# EasyEDA schematic EasyEda_SCH_tally light - main board_2024-01-21.json
TITLE: Main Board; REV: 1.0; Date: 2023-06-19; Sheet: 1/1; Drawn By: michal123456747; Company: Michal Ramus
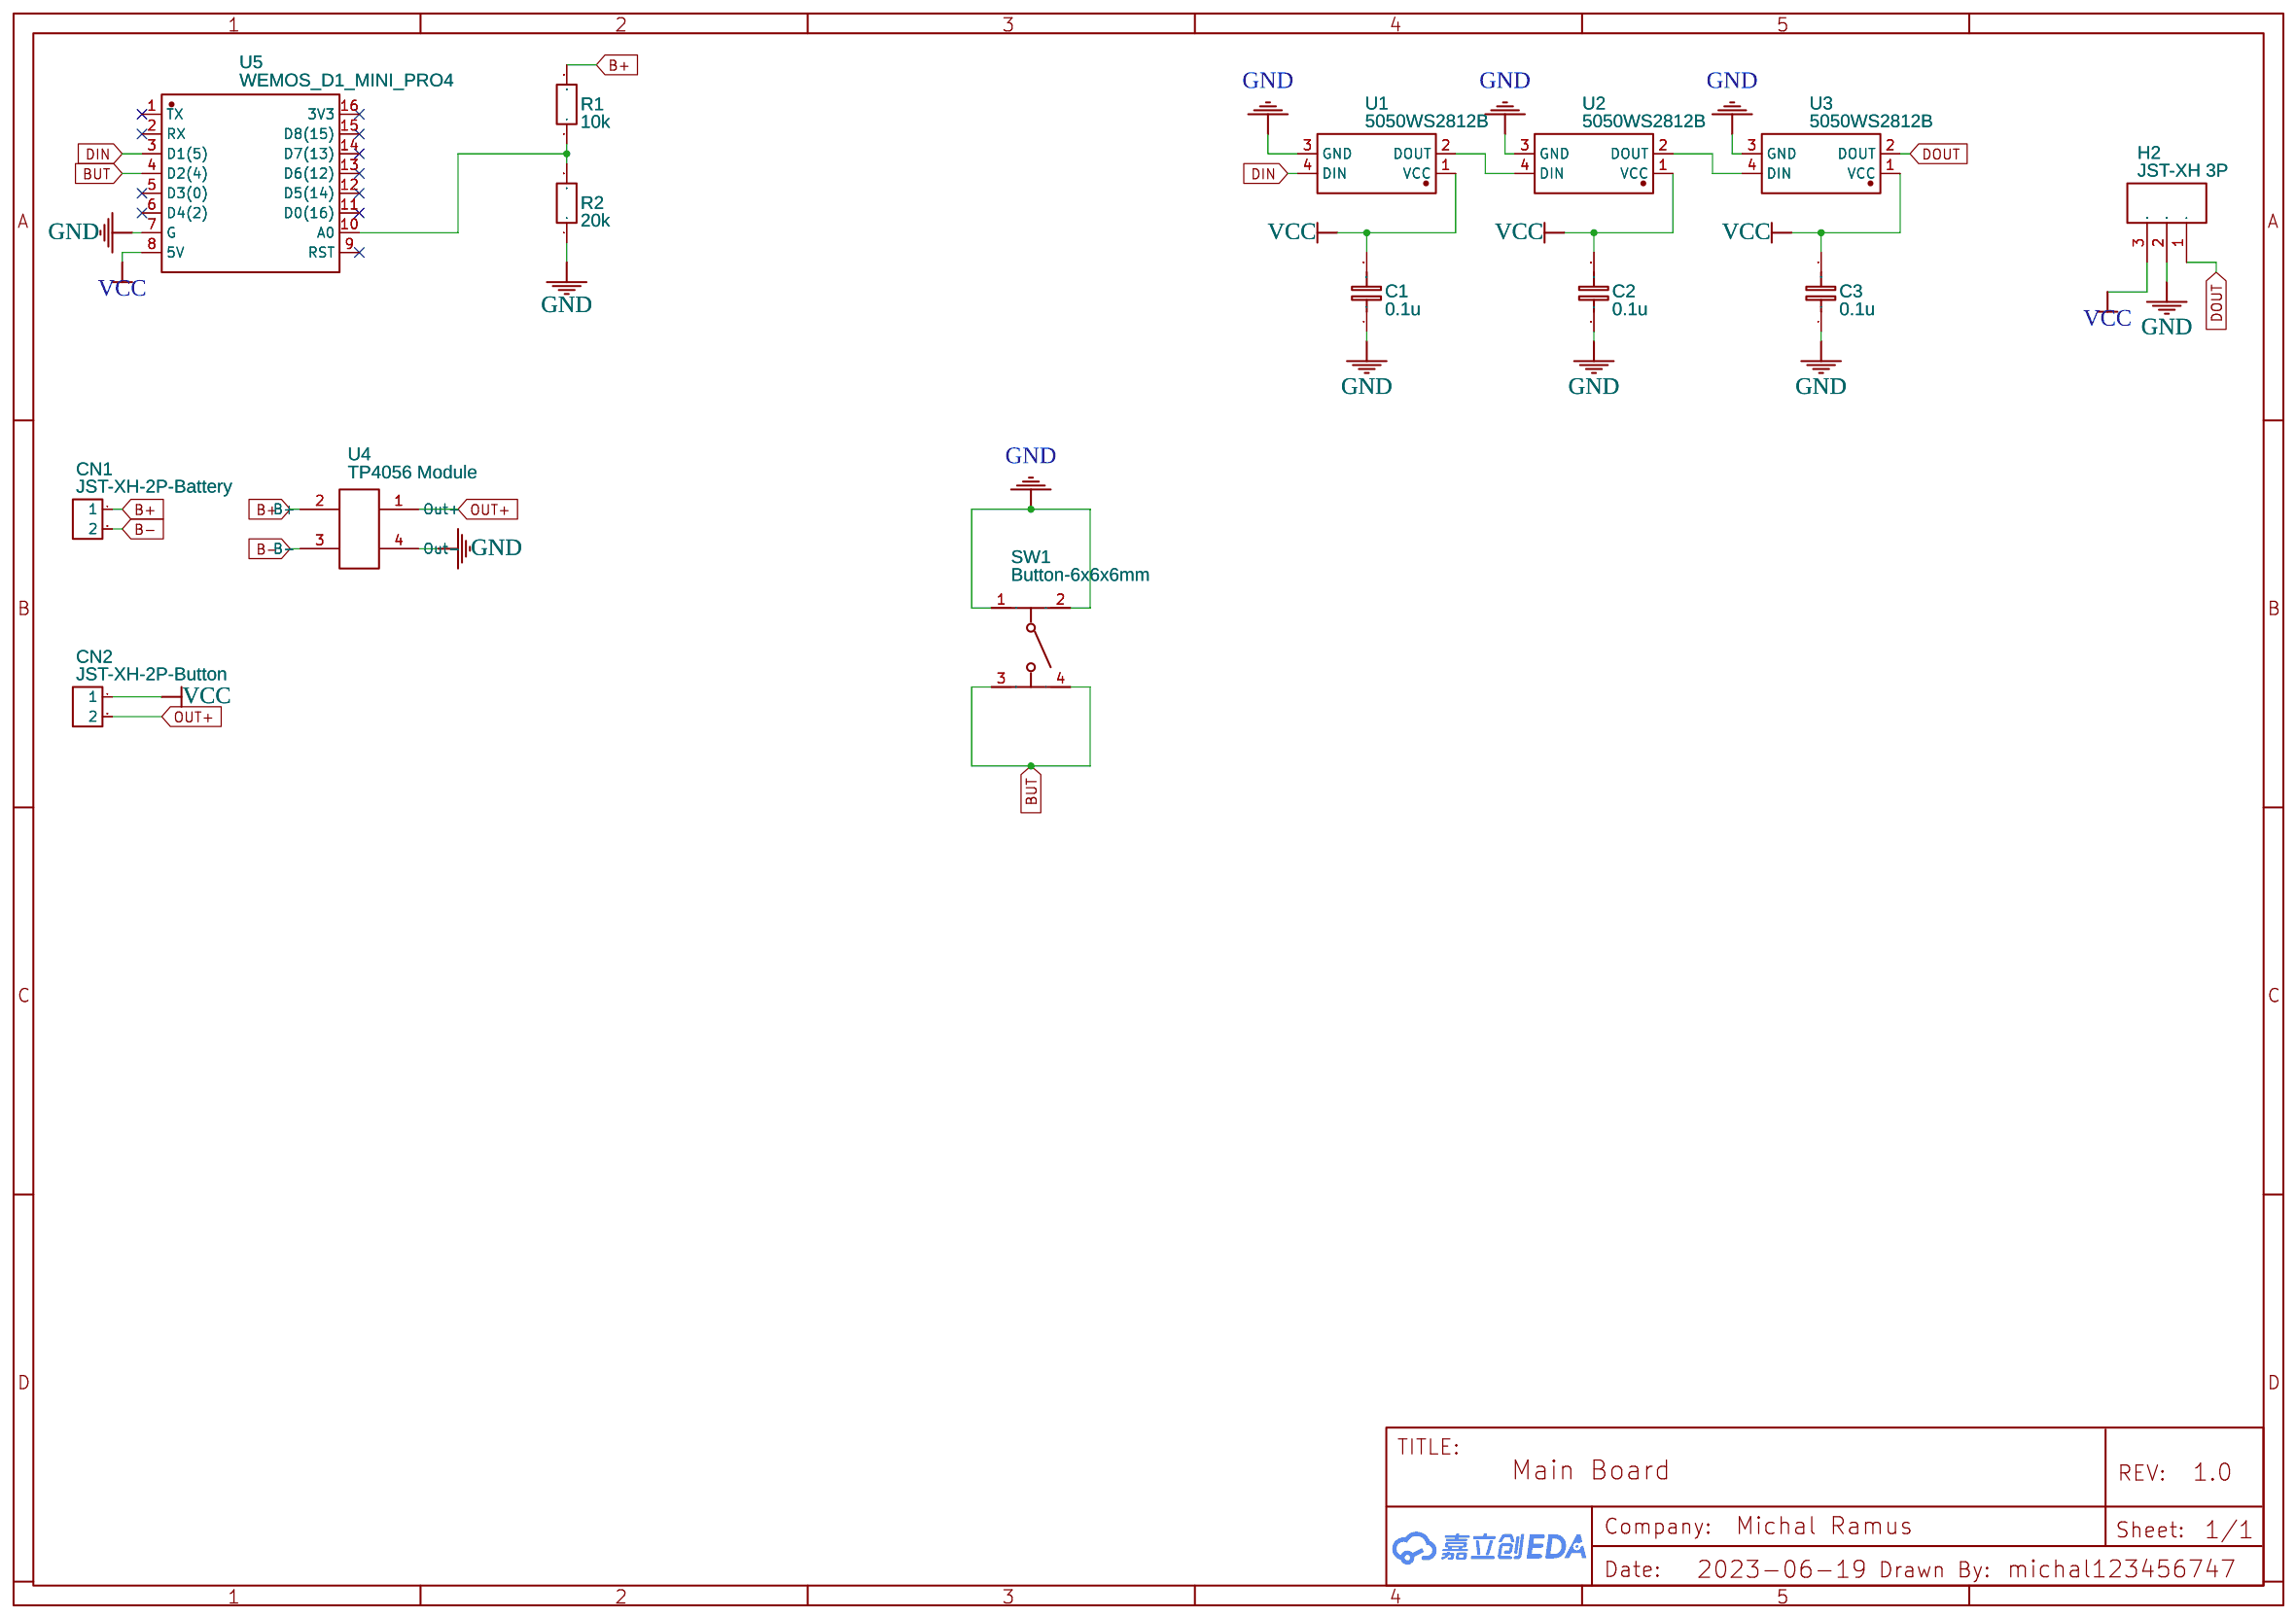
[diagram p0: schematic sheet]

## Parts
C1  0.1u  [C0603]
C2  0.1u  [C0603]
C3  0.1u  [C0603]
CN1  JST-XH-2P-Battery  [CONECT JST-XH-02]
CN2  JST-XH-2P-Button  [CONECT JST-XH-02]
H2  JST-XH 3P  [3PIN_2.54_MM_JST_XHP_JST_CONNECTOR_FOR_DC_SOCKET]
R1  10k  [R0603]
R2  20k  [R0603]
SW1  Button-6x6x6mm  [SW-TH_4P-L6.0-W6.0-P4.50-LS6.1]
U1  5050WS2812B  [LED-SMD_5050WS2812B]
U2  5050WS2812B  [LED-SMD_5050WS2812B]
U3  5050WS2812B  [LED-SMD_5050WS2812B]
U4  TP4056 Module  [TP4056]
U5  WEMOS_D1_MINI_PRO4  [DIP-16_WEMOS_D1_MINI_PRO4]

## Library data of the parts
C1-C3 = C_0603_EU: Contributor: LCEDA_Lib
CN1 CN2 = JST-XH-2P: Manufacturer: JST; Manufacturer Part: JST-XH-2P-M; Supplier Part: JST-XH-2P-M; Contributor: fredy1605
H2 = JST-XH 3P: Contributor: irukaict; subpart_no: 1
R1 R2 = R_0603_EU: Contributor: LCEDA_Lib
SW1 = Button-6x6x6mm: Supplier Part: C71836; Supplier: LCSC; Manufacturer: BBJ; Manufacturer Part: Switch,6*6*6Plastic head,260G, 0.25mm,Straight line
U1-U3 = 5050WS2812B: Supplier: LCSC; Supplier Part: C2874876; Manufacturer: null; JLCPCB Part Class: Extended Part; Contributor: LCSC
U4 = TP4056 Module: Contributor: kaktys36
U5 = WEMOS_D1_MINI_PRO4: Supplier: LCSC; Supplier Part: C2837266; Manufacturer: null; Manufacturer Part: Wemos_D1_mini_Pro4; Contributor: LCSC; JLCPCB Part Class: Extended Part

## Nets
GND: C1.1 C2.1 C3.1 H2.2 R2.1 SW1.1 SW1.2 U1.3(GND) U2.3(GND) U3.3(GND) U4.4(Out-) U5.7(G)
VCC: C1.2 C2.2 C3.2 CN2.1 H2.3 U1.1(VCC) U2.1(VCC) U3.1(VCC) U5.8(5V)
B+: CN1.1 R1.2 U4.2(B+)
B-: CN1.2 U4.3(B-)
BUT: SW1.3 SW1.4 U5.4(D2(4))
DIN: U1.4(DIN) U5.3(D1(5))
DOUT: H2.1 U3.2(DOUT)
OUT+: CN2.2 U4.1(Out+)
Net-(R1-1): R1.1 R2.2 U5.10(A0)
Net-(U1-2): U1.2(DOUT) U2.4(DIN)
Net-(U2-2): U2.2(DOUT) U3.4(DIN)

Not connected (* = marked no-connect by the designer): U5 1(TX)* 2(RX)* 5(D3(0))* 6(D4(2))* 9(RST)* 11(D0(16))* 12(D5(14))* 13(D6(12))* 14(D7(13))* 15(D8(15))* 16(3V3)*
